# Altium project ADH_XC7Z010_SoC.PrjPcb (part 6 of 10)
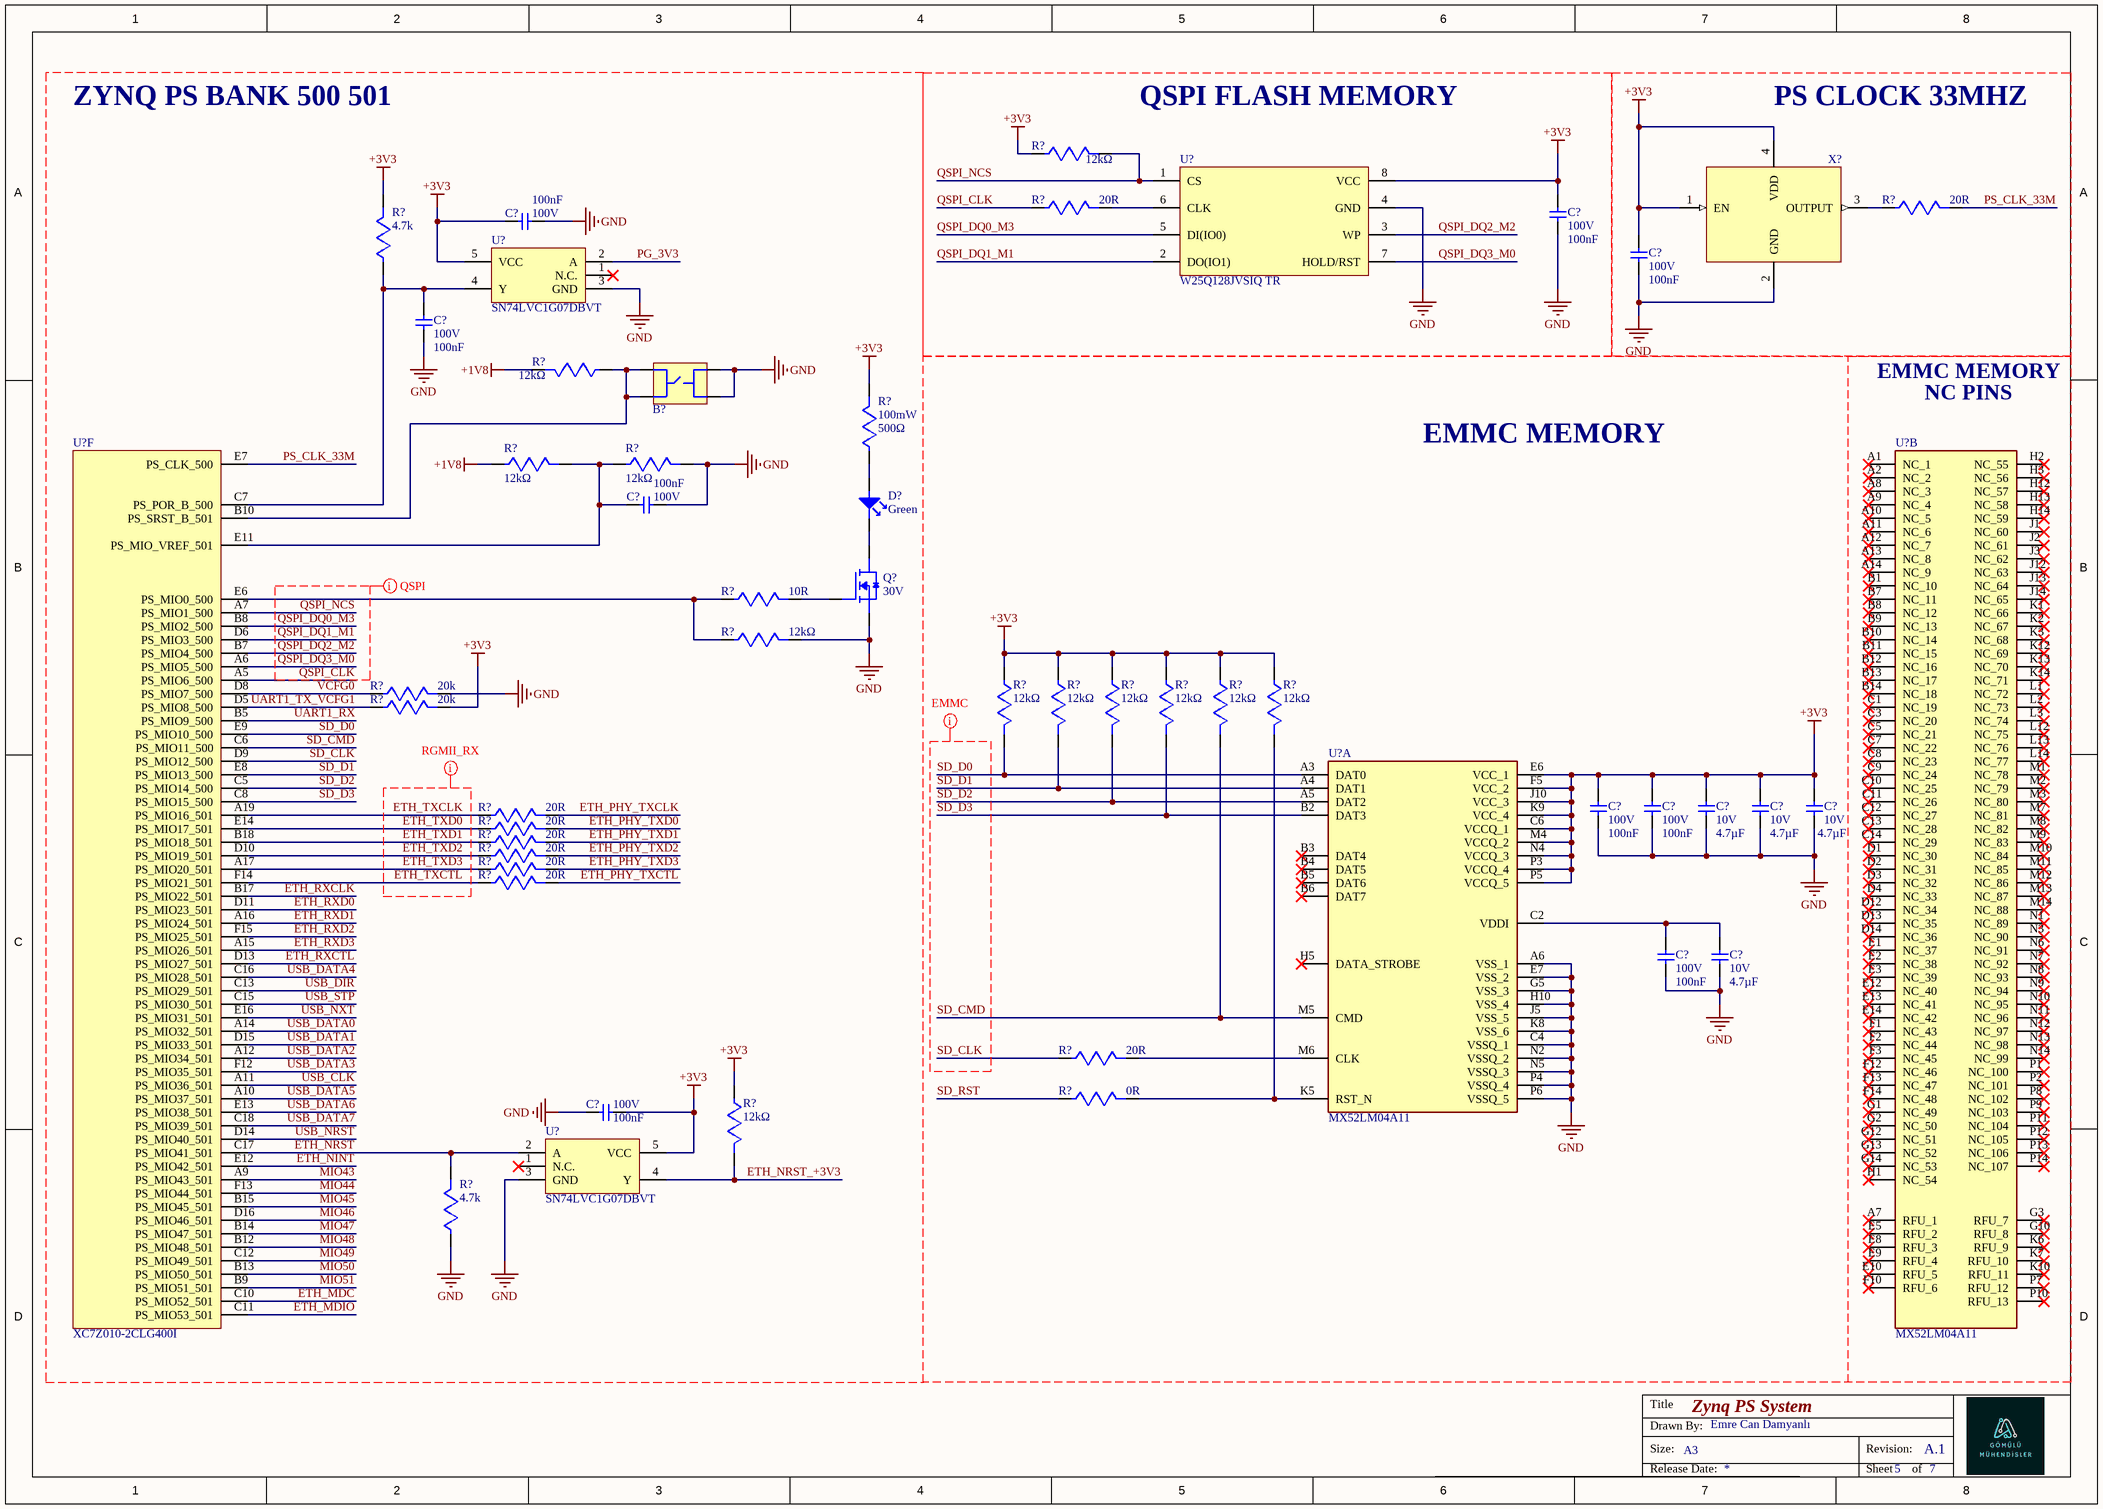
[diagram p11: Zynq_PS_System.SchDoc]

## Sheet Zynq_PS_System.SchDoc: Zynq PS System (continued)

### Library data of the parts
B?#2 = GSPTS0020: Tactile Switch SPST-NO Top Actuated Surface Mount; Datasheet: https://www.ckswitches.com/media/2728/pts815.pdf
C?#116-C?#122 C?#126 C?#128 = GCJ188R72A104KA01D: Cap Ceramic 0.1uF 100V X7R 10% Pad SMD 0603 Soft Termination 125C Automotive T/R; Manufacturer: Murata; Material: 4241ConductorMaterial; Supplier: Digikey; Supplier Part Number: 490-13420-1-ND; Manufacturer Part Number: GCJ188R72A104KA01D; RoHS: Yes; Category: Ceramic Capacitors; Stock: 681954; Pricing: 1=0,19, 10=0,123, 50=0,0774, 100=0,0619, 500=0,04472, 1000=0,03956 (USD); Mounting Technology: Surface Mount; Case/Package: 0603; Case Code (Metric): 1608; Case Code (Imperial): 0603; Min Operating Temperature: -55°C; Max Operating Temperature: 125°C; Packaging: Cut Tape; Tolerance: 10%; Features: Soft Termination; Series: GCJ; Length: 0.063inch; Width: 0.031inch; Height: 900um; Thickness: 0.035inch; Ratings: AEC-Q200; RoHS Compliant: Yes; Lead Free: 5697LeadFree; ComponentLink1URL: https://datasheet.octopart.com/GCJ188R72A104KA01D-Murata-datasheet-78375067.pdf?src-supplier=Future+Electronics; ComponentLink1Description: https://datasheet.octopart.com/GCJ188R72A104KA01D-Murata-datasheet-78375067.pdf?src-supplier=Future+Electronics; ComponentLink2URL: http://search.murata.co.jp/Ceramy/image/img/A01X/partnumbering_e_02.pdf?src-supplier=Digikey; ComponentLink2Description: http://search.murata.co.jp/Ceramy/image/img/A01X/partnumbering_e_02.pdf?src-supplier=Digikey; ComponentLink3URL: https://www.murata.com/~/media/webrenewal/support/library/catalog/products/capacitor/mlcc/c03e.ashx?la=en-us&src-supplier=Digikey; ComponentLink3Description: https://www.murata.com/~/media/webrenewal/support/library/catalog/products/capacitor/mlcc/c03e.ashx?la=en-us&src-supplier=Digikey; ComponentLink4URL: https://datasheet.octopart.com/GCJ188R72A104KA01D-Murata-datasheet-165611796.pdf?src-supplier=TME; ComponentLink4Description: https://datasheet.octopart.com/GCJ188R72A104KA01D-Murata-datasheet-165611796.pdf?src-supplier=TME
C?#123-C?#125 C?#127 = CL05A475MP5NRNC: Ceramic Capacitor, Multilayer, Ceramic, 10V, 20% +Tol, 20% -Tol, X5R, +-15% TC, 4.7uF, Surface Mount, 0402 inch; Manufacturer: Samsung Electro-Mechanics; Supplier: Avnet; Supplier Part Number: CL05A475MP5NRNC; Manufacturer Part Number: CL05A475MP5NRNC; RoHS: Compliant; Category: Ceramic Capacitors; Stock: 40000; Pricing: 10000=0,00671, 20000=0,00663, 40000=0,0066, 80000=0,00656, 160000=0,00653 (USD); Case/Package: 0402; Case Code (Imperial): 0402; Case Code (Metric): 1005; China RoHS: Compliant; Dielectric: X5R; Dielectric Material: Ceramic; Height: 500µm; Lead Free: Lead Free; Length: 1mm; Lifecycle Status: Production; Material: Ceramic; Max Operating Temperature: 85°C; Min Operating Temperature: -55°C; Mounting Technology: Surface Mount; Number of Terminals: 2; REACH SVHC: Yes; Schedule B: 8532240020, 8532240020|8532240020|8532240020|8532240020|8532240020|8532240020|8532240020|8532240020|8532240020|8532240020|8532240020|8532240020|8532240020|8532240020|8532240020|8532240020|8532240020|8532240020|8532240020|8532240020|8532240020|8532240020, 8532240020|8532240020|8532240020|8532240020|8532240020|8532240020|8532240020|8532240020|8532240020|8532240020|8532240020|8532240020|8532240020|8532240020|8532240020|8532240020|8532240020|8532240020|8532240020|8532240020|8532240020|8532240020|8532240020, 8532240020|8532240020|8532240020|8532240020|8532240020|8532240020|8532240020|8532240020|8532240020|8532240020|8532240020|8532240020|8532240020|8532240020|8532240020|8532240020|8532240020|8532240020|8532240020|8532240020|8532240020|8532240020|8532240020|85; Thickness: 558.8µm; Tolerance: 20%; Voltage Rating (DC): 10V; Width: 500µm; ComponentLink1URL: https://datasheet.octopart.com:443/CL05A475MP5NRNC-Samsung-Electro-Mechanics-datasheet-181551186.pdf?src-supplier=Newark; ComponentLink1Description: https://datasheet.octopart.com:443/CL05A475MP5NRNC-Samsung-Electro-Mechanics-datasheet-181551186.pdf?src-supplier=Newark; ComponentLink2URL: https://datasheet.octopart.com:443/CL05A475MP5NRNC-Samsung-Electro-Mechanics-datasheet-136482298.pdf?src-supplier=Newark; ComponentLink2Description: https://datasheet.octopart.com:443/CL05A475MP5NRNC-Samsung-Electro-Mechanics-datasheet-136482298.pdf?src-supplier=Newark; ComponentLink3URL: https://datasheet.octopart.com:443/CL05A475MP5NRNC-Samsung-Electro-Mechanics-datasheet-136031736.pdf?src-supplier=Future+Electronics; ComponentLink3Description: https://datasheet.octopart.com:443/CL05A475MP5NRNC-Samsung-Electro-Mechanics-datasheet-136031736.pdf?src-supplier=Future+Electronics; ComponentLink4URL: https://datasheet.octopart.com:443/CL05A475MP5NRNC-Samsung-Electro-Mechanics-datasheet-110226226.pdf?src-supplier=Future+Electronics; ComponentLink4Description: https://datasheet.octopart.com:443/CL05A475MP5NRNC-Samsung-Electro-Mechanics-datasheet-110226226.pdf?src-supplier=Future+Electronics; ComponentLink5URL: https://datasheet.octopart.com:443/CL05A475MP5NRNC-Samsung-Electro-Mechanics-datasheet-87580058.pdf?src-supplier=Future+Electronics; ComponentLink5Description: https://datasheet.octopart.com:443/CL05A475MP5NRNC-Samsung-Electro-Mechanics-datasheet-87580058.pdf?src-supplier=Future+Electronics; ComponentLink6URL: https://datasheet.octopart.com:443/CL05A475MP5NRNC-Samsung-Electro-Mechanics-datasheet-81461611.pdf?src-supplier=Future+Electronics; ComponentLink6Description: https://datasheet.octopart.com:443/CL05A475MP5NRNC-Samsung-Electro-Mechanics-datasheet-81461611.pdf?src-supplier=Future+Electronics; ComponentLink7URL: https://datasheet.octopart.com:443/CL05A475MP5NRNC-Samsung-datasheet-48647200.pdf?src-supplier=Future+Electronics; ComponentLink7Description: https://datasheet.octopart.com:443/CL05A475MP5NRNC-Samsung-datasheet-48647200.pdf?src-supplier=Future+Electronics; ComponentLink8URL: https://datasheet.octopart.com:443/CL05A475MP5NRNC-Samsung-datasheet-34153549.pdf?src-supplier=Future+Electronics; ComponentLink8Description: https://datasheet.octopart.com:443/CL05A475MP5NRNC-Samsung-datasheet-34153549.pdf?src-supplier=Future+Electronics; ComponentLink9URL: https://datasheet.octopart.com:443/CL05A475MP5NRNC-Samsung-datasheet-26589015.pdf?src-supplier=Future+Electronics; ComponentLink9Description: https://datasheet.octopart.com:443/CL05A475MP5NRNC-Samsung-datasheet-26589015.pdf?src-supplier=Future+Electronics; ComponentLink10URL: https://datasheet.octopart.com:443/CL05A475MP5NRNC-Samsung-datasheet-8324245.pdf?src-supplier=Future+Electronics; ComponentLink10Description: https://datasheet.octopart.com:443/CL05A475MP5NRNC-Samsung-datasheet-8324245.pdf?src-supplier=Future+Electronics; ComponentLink11URL: https://datasheet.octopart.com:443/CL05A475MP5NRNC-Samsung-Electro-Mechanics-datasheet-149136695.pdf?src-supplier=Future+Electronics; ComponentLink11Description: https://datasheet.octopart.com:443/CL05A475MP5NRNC-Samsung-Electro-Mechanics-datasheet-149136695.pdf?src-supplier=Future+Electronics; ComponentLink12URL: https://datasheet.octopart.com:443/CL05A475MP5NRNC-Samsung-datasheet-8326407.pdf?src-supplier=TME; ComponentLink12Description: https://datasheet.octopart.com:443/CL05A475MP5NRNC-Samsung-datasheet-8326407.pdf?src-supplier=TME
D?#7 = LTST-C191KGKT: LTST-C191KGKT Lite-On LED, green, 18-71mcd, 130, 1.9V-2.4V SMD, 0603 1.6x0.8x0.55mm RoHS; Manufacturer: Vishay Lite-On; Lens Color: Colorless; Luminous Intensity: 35mcd; Viewing Angle: 130°; Lens Style: Flat,Rectangular,Colorless; Forward Voltage: 2V; Dominant Wavelength: 571nm; Test Current: 20mA; Lens Transparency: Clear; Wavelength: 574nm; Number of LEDs: 1; Max Power Dissipation: 75mW; Lens Size: 0.8mm; Supplier: Digi-Key; Supplier Part Number: 160-1446-1-ND; Manufacturer Part Number: LTST-C191KGKT; RoHS: Yes; Stock: 1655174; Pricing: 1=0,25, 10=0,136, 100=0,063, 500=0,05818, 1000=0,04557, 2000=0,0446 (USD); Mounting Technology: Surface Mount; Case/Package: 0603; Pins: 2; Case Code (Metric): 1608; Case Code (Imperial): 0603; Min Operating Temperature: -55°C; Max Operating Temperature: 85°C; Packaging: Tape and Reel; Series: -; Length: 1.6mm; Width: 0.8mm; Height: 0.65mm; RoHS Compliant: Yes; Lead Free: Lead Free; ComponentLink1URL: https://datasheet.ciiva.com/2109/ltst-c191kgkt-2109973.pdf?src-supplier=Digi-Key; ComponentLink1Description: https://datasheet.ciiva.com/2109/ltst-c191kgkt-2109973.pdf?src-supplier=Digi-Key
Q?#6 = DMG3402L-7: MOSFET N-CH 30V 4A SOT23; Manufacturer: Diodes; Rds On Max: 52mR; Input Capacitance: 464pF; Rise Time: 1.6ns; Max Power Dissipation: 1.4W; Fall Time: 2ns; Turn-Off Delay Time: 10.3ns; Turn-On Delay Time: 1.9ns; Gate to Source Voltage (Vgs): 12V; Number of Channels: 1; Polarity: N-CHANNEL; Supplier: Digi-Key; Supplier Part Number: DMG3402L-7DICT-ND; Manufacturer Part Number: DMG3402L-7; RoHS: Yes; Category: MOSFETs; Stock: 1011067; Pricing: 1=0,42, 10=0,298, 100=0,1503, 500=0,13316, 1000=0,10363 (USD); Mounting Technology: Surface Mount; Case/Package: SOT-23; Pins: 3; Weight: 0.000282oz; Min Operating Temperature: -55°C; Max Operating Temperature: 150°C; Package Quantity: 3000; Packaging: Tape and Reel; Continuous Drain Current (ID): 4A; Drain to Source Resistance: 52mR; Series: -; RoHS Compliant: Yes; Lead Free: Lead Free; ComponentLink1URL: http://www.mouser.com/ds/2/115/DMG3402L-473526.pdf?src-supplier=Mouser; ComponentLink1Description: http://www.mouser.com/ds/2/115/DMG3402L-473526.pdf?src-supplier=Mouser; ComponentLink2URL: http://diodes.com/datasheets/DMG3402L.pdf?src-supplier=Avnet; ComponentLink2Description: http://diodes.com/datasheets/DMG3402L.pdf?src-supplier=Avnet
R?#74 R?#78 R?#80 R?#81 R?#83 R?#85-R?#90 R?#100 = RC0603FR-0712KL: 100mW Thick Film Resistors 75V ±100ppm/℃ ±1% 12kΩ 0603 Chip Resistor - Surface Mount ROHS; Manufacturer: Yageo Group; Temperature Coefficient: 100ppm/°C; Voltage Rating: 50V; Supplier: Farnell; Supplier Part Number: 9238611; Manufacturer Part Number: RC0603FR-0712KL; RoHS: Compliant; Category: Chip SMD Resistors; Stock: 298850; Pricing: 10=0,0061, 100=0,0052, 500=0,0048, 1000=0,0043, 2500=0,0036 (EUR); Case/Package: 0603; Case Code (Imperial): 0603; Case Code (Metric): 1608; China RoHS: Non-Compliant; Composition: Thick Film; Depth: 800µm; Features: Moisture Resistant; Height: 450µm; Lead Free: Lead Free; Length: 1.6mm; Lifecycle Status: Production; Max Operating Temperature: 155°C; Max Power Dissipation: 100mW; Military Standard: Not; Min Operating Temperature: -55°C; Mounting Technology: Surface Mount; Pins: 2; Number of Terminals: 2; Number of Terminations: 2; Packaging: Tape and Reel; Power Dissipation: 100mW; Power Rating: 100mW; REACH SVHC: Yes; Schedule B: 8533210045, 8533210045|8533210045|8533210045|8533210045|8533210045; Termination: SMD/SMT; Tolerance: 1%; Voltage Rating (DC): 50V; Width: 800µm; Working Voltage: 75V; ComponentLink1URL: https://datasheet.octopart.com:443/RC0603FR-0712KL-Yageo-datasheet-175887523.pdf?src-supplier=IHS; ComponentLink1Description: https://datasheet.octopart.com:443/RC0603FR-0712KL-Yageo-datasheet-175887523.pdf?src-supplier=IHS; ComponentLink2URL: https://datasheet.octopart.com:443/RC0603FR-0712KL-Yageo-datasheet-8328172.pdf?src-supplier=Newark; ComponentLink2Description: https://datasheet.octopart.com:443/RC0603FR-0712KL-Yageo-datasheet-8328172.pdf?src-supplier=Newark; ComponentLink3URL: https://datasheet.octopart.com:443/RC0603FR-0712KL-Yageo-datasheet-175423674.pdf?src-supplier=Newark; ComponentLink3Description: https://datasheet.octopart.com:443/RC0603FR-0712KL-Yageo-datasheet-175423674.pdf?src-supplier=Newark; ComponentLink4URL: https://datasheet.octopart.com:443/RC0603FR-0712KL-Yageo-datasheet-34211833.pdf?src-supplier=Newark; ComponentLink4Description: https://datasheet.octopart.com:443/RC0603FR-0712KL-Yageo-datasheet-34211833.pdf?src-supplier=Newark; ComponentLink5URL: https://datasheet.octopart.com:443/RC0603FR-0712KL-Yageo-datasheet-62067350.pdf?src-supplier=element14+APAC; ComponentLink5Description: https://datasheet.octopart.com:443/RC0603FR-0712KL-Yageo-datasheet-62067350.pdf?src-supplier=element14+APAC; ComponentLink6URL: https://datasheet.octopart.com:443/RC0603FR-0712KL-Yageo-datasheet-103092701.pdf?src-supplier=Upverter; ComponentLink6Description: https://datasheet.octopart.com:443/RC0603FR-0712KL-Yageo-datasheet-103092701.pdf?src-supplier=Upverter; ComponentLink7URL: https://datasheet.octopart.com:443/RC0603FR-0712KL-Yageo-datasheet-141435368.pdf?src-supplier=Upverter; ComponentLink7Description: https://datasheet.octopart.com:443/RC0603FR-0712KL-Yageo-datasheet-141435368.pdf?src-supplier=Upverter; ComponentLink8URL: https://datasheet.octopart.com:443/RC0603FR-0712KL-Yageo-Group-datasheet-190305687.pdf?src-supplier=Future+Electronics; ComponentLink8Description: https://datasheet.octopart.com:443/RC0603FR-0712KL-Yageo-Group-datasheet-190305687.pdf?src-supplier=Future+Electronics; ComponentLink9URL: https://datasheet.octopart.com:443/RC0603FR-0712KL-Yageo-datasheet-164759695.pdf?src-supplier=Future+Electronics; ComponentLink9Description: https://datasheet.octopart.com:443/RC0603FR-0712KL-Yageo-datasheet-164759695.pdf?src-supplier=Future+Electronics; ComponentLink10URL: https://datasheet.octopart.com:443/RC0603FR-0712KL-Yageo-datasheet-137700087.pdf?src-supplier=Future+Electronics; ComponentLink10Description: https://datasheet.octopart.com:443/RC0603FR-0712KL-Yageo-datasheet-137700087.pdf?src-supplier=Future+Electronics; ComponentLink11URL: https://datasheet.octopart.com:443/RC0603FR0712KL-Yageo-datasheet-27584510.pdf?src-supplier=Future+Electronics; ComponentLink11Description: https://datasheet.octopart.com:443/RC0603FR0712KL-Yageo-datasheet-27584510.pdf?src-supplier=Future+Electronics; ComponentLink12URL: https://datasheet.octopart.com:443/RC0603FR-0712KL-Yageo-datasheet-15599030.pdf?src-supplier=Future+Electronics; ComponentLink12Description: https://datasheet.octopart.com:443/RC0603FR-0712KL-Yageo-datasheet-15599030.pdf?src-supplier=Future+Electronics; ComponentLink13URL: https://datasheet.octopart.com:443/RC0603FR-0712KL-Yageo-datasheet-12596169.pdf?src-supplier=Future+Electronics; ComponentLink13Description: https://datasheet.octopart.com:443/RC0603FR-0712KL-Yageo-datasheet-12596169.pdf?src-supplier=Future+Electronics; ComponentLink14URL: https://datasheet.octopart.com:443/RC0603FR-0712KL-Yageo-datasheet-8324193.pdf?src-supplier=Future+Electronics; ComponentLink14Description: https://datasheet.octopart.com:443/RC0603FR-0712KL-Yageo-datasheet-8324193.pdf?src-supplier=Future+Electronics; ComponentLink15URL: https://datasheet.octopart.com:443/RC0603FR-0712KL-Yageo-Group-datasheet-176638170.pdf?src-supplier=Farnell; ComponentLink15Description: https://datasheet.octopart.com:443/RC0603FR-0712KL-Yageo-Group-datasheet-176638170.pdf?src-supplier=Farnell; ComponentLink16URL: https://datasheet.octopart.com/RC0603FR-0712KL-Yageo-datasheet-73766026.pdf; ComponentLink16Description: https://datasheet.octopart.com/RC0603FR-0712KL-Yageo-datasheet-73766026.pdf; ComponentLink17URL: https://datasheet.octopart.com:443/RC0603FR-0712KL-Yageo-datasheet-30459151.pdf?src-supplier=Seeed+Studio; ComponentLink17Description: https://datasheet.octopart.com:443/RC0603FR-0712KL-Yageo-datasheet-30459151.pdf?src-supplier=Seeed+Studio; ComponentLink18URL: https://datasheet.octopart.com:443/RC0603FR-0712KL-Yageo-datasheet-118562.pdf?src-supplier=DigiKey; ComponentLink18Description: https://datasheet.octopart.com:443/RC0603FR-0712KL-Yageo-datasheet-118562.pdf?src-supplier=DigiKey; ComponentLink19URL: http://sigma.octopart.com:80/conflict_mineral_statement/Yageo-company-3.pdf?src-supplier=Compliance+Statements; ComponentLink19Description: http://sigma.octopart.com:80/conflict_mineral_statement/Yageo-company-3.pdf?src-supplier=Compliance+Statements; ComponentLink20URL: http://sigma.octopart.com:80/rohs_statement/Yageo-company-2.pdf?src-supplier=Compliance+Statements; ComponentLink20Description: http://sigma.octopart.com:80/rohs_statement/Yageo-company-2.pdf?src-supplier=Compliance+Statements
R?#75 R?#76 R?#92-R?#98 = RC0603FR-0720RL: SMD Chip Resistor, 20 Ohm, ± 1%, 100 mW, 0603 [1608 Metric], Thick Film, General Purpose; Manufacturer: Yageo; Power Rating: 100mW; Voltage Rating: 50V; Temperature Coefficient: 100ppm/°C; Working Voltage: 75V; Supplier: Digi-Key; Supplier Part Number: 311-20.0HRCT-ND; Manufacturer Part Number: RC0603FR-0720RL; RoHS: Yes; Category: Chip SMD Resistors; Stock: 293682; Pricing: 1=0,1, 10=0,018, 50=0,0106, 100=0,0088, 500=0,00592, 1000=0,00505 (USD); Case/Package: 0603; Case Code (Imperial): 0603; Case Code (Metric): 1608; Min Operating Temperature: -55°C; Max Operating Temperature: 155°C; Tolerance: 1%; Packaging: Tape and Reel; Package Quantity: 5000; Termination: SMD/SMT; Resistor Type: Thick Film; Number of Terminations: 2; Max Power Dissipation: 100mW; Voltage Rating (DC): 50V; Features: Moisture Resistant; Series: RC; Construction: Rectangular; Technology: THICK FILM; Resistance Tolerance: 1%; Length: 1.6mm; Width: 0.031inch; Height: 0.45mm; Depth: 0.8mm; Reach SVHC Compliant: No; Military Standard: Not; Lead Free: Lead Free; RoHS Compliant: Yes; ComponentLink1URL: https://datasheet.ciiva.com/11819/0900766b80f96399-11819290.pdf?src-supplier=Rs; ComponentLink1Description: https://datasheet.ciiva.com/11819/0900766b80f96399-11819290.pdf?src-supplier=Rs; ComponentLink2URL: https://datasheet.ciiva.com/46395/443971-46395031.pdf?src-supplier=Element14; ComponentLink2Description: https://datasheet.ciiva.com/46395/443971-46395031.pdf?src-supplier=Element14; ComponentLink3URL: https://datasheet.ciiva.com/2454/pyu-r-int-thick-7-2454028.pdf?src-supplier=Digi-Key; ComponentLink3Description: https://datasheet.ciiva.com/2454/pyu-r-int-thick-7-2454028.pdf?src-supplier=Digi-Key; ComponentLink4URL: https://datasheet.ciiva.com/2454/pyu-r-int-thick-7-2454029.pdf?src-supplier=Digi-Key; ComponentLink4Description: https://datasheet.ciiva.com/2454/pyu-r-int-thick-7-2454029.pdf?src-supplier=Digi-Key; ComponentLink5URL: https://datasheet.ciiva.com/2454/pyu-r-int-thick-7-2454027.pdf?src-supplier=Digi-Key; ComponentLink5Description: https://datasheet.ciiva.com/2454/pyu-r-int-thick-7-2454027.pdf?src-supplier=Digi-Key; ComponentLink6URL: https://datasheet.ciiva.com/12557/rc0603-272842-12557941.pdf?src-supplier=Mouser; ComponentLink6Description: https://datasheet.ciiva.com/12557/rc0603-272842-12557941.pdf?src-supplier=Mouser; ComponentLink7URL: https://datasheet.ciiva.com/15189/getdatasheetpartid-324013-15189653.pdf?src-supplier=Verical; ComponentLink7Description: https://datasheet.ciiva.com/15189/getdatasheetpartid-324013-15189653.pdf?src-supplier=Verical
R?#77 R?#101 = RC0603FR-074K7L: SMD Chip Resistor, 4.7 kOhm, ± 1%, 100 mW, 0603 [1608 Metric], Thick Film, General Purpose; Manufacturer: Yageo; Power Rating: 100mW; Voltage Rating (DC): 50V; Temperature Coefficient: 100ppm/°C; Supplier: Digi-Key; Supplier Part Number: 311-4.70KHRCT-ND; Manufacturer Part Number: RC0603FR-074K7L; RoHS: Yes; Category: Chip SMD Resistors; Stock: 7233601; Pricing: 1=0,1, 10=0,018, 50=0,0106, 100=0,0088, 500=0,00592, 1000=0,00505 (USD); Case/Package: 0603; Pins: 2; Case Code (Imperial): 0603; Case Code (Metric): 1608; Min Operating Temperature: -55°C; Max Operating Temperature: 155°C; Tolerance: 1%; Resistor Type: Thick Film; Packaging: Tape and Reel; Voltage Rating: 50V; Termination: SMD/SMT; Features: Moisture Resistant; Series: RC; Max Power Dissipation: 100mW; Number of Terminations: 2; Construction: Rectangular; Resistance Tolerance: 1%; Length: 1.6mm; Width: 0.8mm; Depth: 0.8mm; Lead Pitch: 0.3mm; Lead Free: Lead Free; Reach SVHC Compliant: Unknown; RoHS Compliant: Yes; Military Standard: Not; ComponentLink1URL: https://datasheet.ciiva.com/15189/getdatasheetpartid-422754-15189760.pdf?src-supplier=Verical; ComponentLink1Description: https://datasheet.ciiva.com/15189/getdatasheetpartid-422754-15189760.pdf?src-supplier=Verical; ComponentLink2URL: https://datasheet.ciiva.com/7660/38590-7660794.pdf?src-supplier=Element14; ComponentLink2Description: https://datasheet.ciiva.com/7660/38590-7660794.pdf?src-supplier=Element14; ComponentLink3URL: https://datasheet.ciiva.com/22747/443971-22747528.pdf?src-supplier=Element14; ComponentLink3Description: https://datasheet.ciiva.com/22747/443971-22747528.pdf?src-supplier=Element14; ComponentLink4URL: https://datasheet.ciiva.com/46440/1868787-46440909.pdf?src-supplier=Element14; ComponentLink4Description: https://datasheet.ciiva.com/46440/1868787-46440909.pdf?src-supplier=Element14; ComponentLink5URL: https://datasheet.ciiva.com/7746/1868787-7746365.pdf?src-supplier=Element14; ComponentLink5Description: https://datasheet.ciiva.com/7746/1868787-7746365.pdf?src-supplier=Element14; ComponentLink6URL: https://datasheet.ciiva.com/7746/1738695-7746366.pdf?src-supplier=Element14; ComponentLink6Description: https://datasheet.ciiva.com/7746/1738695-7746366.pdf?src-supplier=Element14
R?#79 = RT0603BRC07500RL: Fixed Resistor, Thin Film, 0.1W, 500ohm, 75V, 0.1% +/-Tol, 15ppm/Cel, Surface Mount, 0603; Manufacturer: Yageo Group; Temperature Coefficient: 15ppm/°C; Supplier: Farnell; Supplier Part Number: 4152629; Manufacturer Part Number: RT0603BRC07500RL; RoHS: Compliant; Category: Chip SMD Resistors; Stock: 4870; Pricing: 5000=0,12 (EUR); Case/Package: 0603; China RoHS: Non-Compliant; Composition: Thin Film; Height: 450µm; Lifecycle Status: Production; Max Operating Temperature: 155°C; Min Operating Temperature: -55°C; Mounting Technology: Surface Mount; Number of Terminals: 2; Packaging: Tape & Reel; Power Dissipation: 100mW; REACH SVHC: Yes; Tolerance: 0.1%; Voltage Rating: 75V; Width: 800µm; Working Voltage: 75V; ComponentLink1URL: https://datasheet.octopart.com:443/RT0603BRC07500RL-Yageo-datasheet-176402239.pdf?src-supplier=IHS; ComponentLink1Description: https://datasheet.octopart.com:443/RT0603BRC07500RL-Yageo-datasheet-176402239.pdf?src-supplier=IHS; ComponentLink2URL: https://datasheet.octopart.com:443/RT0603BRC07500RL-Yageo-datasheet-141265893.pdf?src-supplier=ODG+(Origin+Data+Global); ComponentLink2Description: https://datasheet.octopart.com:443/RT0603BRC07500RL-Yageo-datasheet-141265893.pdf?src-supplier=ODG+(Origin+Data+Global); ComponentLink3URL: https://datasheet.octopart.com:443/RT0603BRC07500RL-Yageo-datasheet-169971040.pdf?src-supplier=Upverter; ComponentLink3Description: https://datasheet.octopart.com:443/RT0603BRC07500RL-Yageo-datasheet-169971040.pdf?src-supplier=Upverter; ComponentLink4URL: https://datasheet.octopart.com:443/RT0603BRC07500RL-Yageo-datasheet-166250672.pdf?src-supplier=Future+Electronics; ComponentLink4Description: https://datasheet.octopart.com:443/RT0603BRC07500RL-Yageo-datasheet-166250672.pdf?src-supplier=Future+Electronics; ComponentLink5URL: https://datasheet.octopart.com/RT0603BRC07500RL-Yageo-datasheet-86813807.pdf; ComponentLink5Description: https://datasheet.octopart.com/RT0603BRC07500RL-Yageo-datasheet-86813807.pdf; ComponentLink6URL: http://sigma.octopart.com:80/rohs_statement/Yageo-company-2.pdf?src-supplier=Compliance+Statements; ComponentLink6Description: http://sigma.octopart.com:80/rohs_statement/Yageo-company-2.pdf?src-supplier=Compliance+Statements; ComponentLink7URL: http://sigma.octopart.com:80/conflict_mineral_statement/Yageo-company-3.pdf?src-supplier=Compliance+Statements; ComponentLink7Description: http://sigma.octopart.com:80/conflict_mineral_statement/Yageo-company-3.pdf?src-supplier=Compliance+Statements
R?#82 = RC0603FR-0710RL: SMD Chip Resistor, 10 Ohm, ± 1%, 100 mW, 0603 [1608 Metric], Thick Film, General Purpose; Manufacturer: Yageo; Voltage Rating (DC): 50V; Temperature Coefficient: 200ppm/°C; Max Power Dissipation: 100mW; Supplier: Digi-Key; Supplier Part Number: 311-10.0HRCT-ND; Manufacturer Part Number: RC0603FR-0710RL; RoHS: Yes; Category: Chip SMD Resistors; Stock: 1593496; Pricing: 1=0,1, 10=0,028, 50=0,018, 100=0,015, 500=0,0104, 1000=0,00901 (USD); Case/Package: 0603; Pins: 2; Case Code (Imperial): 0603; Case Code (Metric): 1608; Contact Plating: Tin,Matte; Min Operating Temperature: -55°C; Max Operating Temperature: 155°C; Packaging: Tape and Reel; Tolerance: 1%; Features: Moisture Resistant; Series: RC; Number of Terminations: 2; Power Rating: 100mW; Voltage Rating: 50V; Termination: SMD/SMT; Resistor Type: Thick Film; Resistance Tolerance: 1%; Construction: Rectangular; Technology: THICK FILM; Voltage Rating (AC): 50V; Length: 1.6mm; Width: 0.8mm; Height: 0.45mm; Depth: 0.8mm; Lead Free: Lead Free; RoHS Compliant: Yes; Reach SVHC Compliant: No; Military Standard: Not; ComponentLink1URL: https://datasheet.ciiva.com/11808/0900766b80f96399-11808140.pdf?src-supplier=Rs; ComponentLink1Description: https://datasheet.ciiva.com/11808/0900766b80f96399-11808140.pdf?src-supplier=Rs; ComponentLink2URL: https://datasheet.ciiva.com/7746/443971-7746245.pdf?src-supplier=Element14; ComponentLink2Description: https://datasheet.ciiva.com/7746/443971-7746245.pdf?src-supplier=Element14; ComponentLink3URL: https://datasheet.ciiva.com/8891/pyu-rc0603-51-rohs-l-4-8891285.pdf?src-supplier=Avnet; ComponentLink3Description: https://datasheet.ciiva.com/8891/pyu-rc0603-51-rohs-l-4-8891285.pdf?src-supplier=Avnet
R?#84 R?#91 = RC0603FR-0720KL: SMD Chip Resistor, 20 kOhm, ± 1%, 100 mW, 0603 [1608 Metric], Thick Film, General Purpose; Manufacturer: Yageo; Temperature Coefficient: 100ppm/°C; Voltage Rating (DC): 50V; Power Rating: 100mW; Supplier: Digi-Key; Supplier Part Number: 311-20.0KHRCT-ND; Manufacturer Part Number: RC0603FR-0720KL; RoHS: Yes; Category: Chip SMD Resistors; Stock: 6106196; Pricing: 1=0,1, 10=0,018, 50=0,0106, 100=0,0088, 500=0,00592, 1000=0,00505 (USD); Case/Package: 0603; Pins: 2NUMBER; Case Code (Imperial): 0603; Case Code (Metric): 1608; Min Operating Temperature: -55°C; Max Operating Temperature: 155°C; Tolerance: 1%; Packaging: Tape and Reel; Resistor Type: Thick Film; Voltage Rating: 50V; Package Quantity: 1; Termination: SMD/SMT; Number of Terminations: 2; Max Power Dissipation: 100mW; Features: Moisture Resistant; Series: RC; Technology: THICK FILM; Construction: Rectangular; Resistance Tolerance: 1%; Length: 0.063inch; Width: 0.031inch; Height: 0.022inch; Depth: 0.8mm; RoHS Compliant: Yes; Lead Free: 5697LeadFree; Reach SVHC Compliant: No; Military Standard: Not; ComponentLink1URL: https://datasheet.ciiva.com/11808/0900766b80f96399-11808275.pdf?src-supplier=Rs; ComponentLink1Description: https://datasheet.ciiva.com/11808/0900766b80f96399-11808275.pdf?src-supplier=Rs; ComponentLink2URL: https://datasheet.ciiva.com/22747/443971-22747525.pdf?src-supplier=Element14; ComponentLink2Description: https://datasheet.ciiva.com/22747/443971-22747525.pdf?src-supplier=Element14; ComponentLink3URL: https://datasheet.ciiva.com/2453/pyu-r-int-thick-7-2453911.pdf?src-supplier=Digi-Key; ComponentLink3Description: https://datasheet.ciiva.com/2453/pyu-r-int-thick-7-2453911.pdf?src-supplier=Digi-Key; ComponentLink4URL: https://datasheet.ciiva.com/2453/pyu-r-int-thick-7-2453912.pdf?src-supplier=Digi-Key; ComponentLink4Description: https://datasheet.ciiva.com/2453/pyu-r-int-thick-7-2453912.pdf?src-supplier=Digi-Key; ComponentLink5URL: https://datasheet.ciiva.com/2453/pyu-r-int-thick-7-2453910.pdf?src-supplier=Digi-Key; ComponentLink5Description: https://datasheet.ciiva.com/2453/pyu-r-int-thick-7-2453910.pdf?src-supplier=Digi-Key
R?#99 = RC0603FR-070RL: Zero Ohm Resistor, Jumper, 0603 [1608 Metric], Thick Film, 100 mW, 1 A, Surface Mount; Manufacturer: Yageo; Power Rating: 100mW; Tolerance: 1%; Voltage Rating (DC): 50V; Temperature Coefficient: 200ppm/°C; Supplier: Digi-Key; Supplier Part Number: 311-0.0HRCT-ND; Manufacturer Part Number: RC0603FR-070RL; RoHS: Yes; Category: Chip SMD Resistors; Stock: 1785115; Pricing: 1=0,1, 10=0,017, 25=0,0132, 50=0,01, 100=0,007, 250=0,0056, 500=0,00448, 1000=0,00329 (USD); Case/Package: 0603; Pins: 2NUMBER; Contact Plating: Tin,Matte; Case Code (Metric): 1608; Case Code (Imperial): 0603; Min Operating Temperature: -55°C; Max Operating Temperature: 155°C; Packaging: Tape and Reel; Resistor Type: Thick Film; Package Quantity: 5000; Voltage Rating: 50V; Number of Terminations: 2; Termination: SMD/SMT; Max Power Dissipation: 100mW; Features: Moisture Resistant; Series: RC; Construction: Rectangular; Resistance Tolerance: 1%; Technology: THICK FILM; Length: 1.6mm; Width: 0.8mm; Height: 0.45mm; Depth: 0.8mm; Reach SVHC Compliant: No; RoHS Compliant: Yes; Lead Free: 5697LeadFree; Military Standard: Not; ComponentLink1URL: https://datasheet.ciiva.com/11808/0900766b80f96399-11808172.pdf?src-supplier=Rs; ComponentLink1Description: https://datasheet.ciiva.com/11808/0900766b80f96399-11808172.pdf?src-supplier=Rs; ComponentLink2URL: https://datasheet.ciiva.com/5684/443971-5684699.pdf?src-supplier=Farnell; ComponentLink2Description: https://datasheet.ciiva.com/5684/443971-5684699.pdf?src-supplier=Farnell; ComponentLink3URL: https://datasheet.ciiva.com/7983/443971-7983627.pdf?src-supplier=Element14; ComponentLink3Description: https://datasheet.ciiva.com/7983/443971-7983627.pdf?src-supplier=Element14; ComponentLink4URL: https://datasheet.ciiva.com/22643/1868787-22643388.pdf?src-supplier=Element14; ComponentLink4Description: https://datasheet.ciiva.com/22643/1868787-22643388.pdf?src-supplier=Element14; ComponentLink5URL: https://datasheet.ciiva.com/46382/443971-46382072.pdf?src-supplier=Element14; ComponentLink5Description: https://datasheet.ciiva.com/46382/443971-46382072.pdf?src-supplier=Element14; ComponentLink6URL: https://datasheet.ciiva.com/29721/pyu-r-int-thick-7-29721178.pdf?src-supplier=Digi-Key; ComponentLink6Description: https://datasheet.ciiva.com/29721/pyu-r-int-thick-7-29721178.pdf?src-supplier=Digi-Key; ComponentLink7URL: https://datasheet.ciiva.com/29721/pyu-rc0603-51-rohs-l-4-29721179.pdf?src-supplier=Digi-Key; ComponentLink7Description: https://datasheet.ciiva.com/29721/pyu-rc0603-51-rohs-l-4-29721179.pdf?src-supplier=Digi-Key; ComponentLink8URL: https://datasheet.ciiva.com/5558/rc0603-272842-5558341.pdf?src-supplier=Mouser; ComponentLink8Description: https://datasheet.ciiva.com/5558/rc0603-272842-5558341.pdf?src-supplier=Mouser
U?#14 = W25Q128JVSIQ TR: Flash, 16MX8, PDSO8; Manufacturer: Winbond; Package Body Material: Plastic; Clock Frequency: 133MHz; Density: 134217728b; Memory Width: 8; Channels: 1; Memory Size: 16777216; Number of Words Code: 16M; Operating Mode: SYNCHRONOUS; Parallel/Serial: SERIAL; Programming Voltage: 3V; Max Supply Voltage: 3.6V; Min Supply Voltage: 2.7V; Supplier 1: Digikey; Manufacturer Part Number: W25Q128JVSIQ TR; RoHS: Yes; Category: Flash; Stock 1: 326186; Pricing 1: 1=1.72, 10=1.572, 25=1.53, 50=1.522, 100=1.3605, 250=1.3566, 500=1.3361, 1000=1.27939 (USD); Case/Package: SOP; Pins: 8; Package Shape: Square; Min Operating Temperature: -40°C; Max Operating Temperature: 85°C; Memory Format: FLASH; Type: NOR TYPE; JESD-30 Code: S-PDSO-G8; Organization: 16MX8; Package Style: SMALL OUTLINEMeter; Nominal Supply Voltage: 3V; Surface Mount: Yes; Technology: CMOS; Terminal Form: Gull Wing; Terminal Position: DUAL; Length: 5.23mm; Width: 5.23mm; Height - Seated (Max): 2.16mm; Terminal Pitch: 1.27mm; Temperature Grade: INDUSTRIAL; Reach SVHC Compliant: Yes; RoHS Compliant: Yes; ComponentLink1URL: https://datasheet.ciiva.com:443/pdfs/VipMasterIC/IC/WBND/WBND-S-A0002933800/WBND-S-A0002933800-1.pdf?src-supplier=IHS+Markit; ComponentLink1Description: https://datasheet.ciiva.com:443/pdfs/VipMasterIC/IC/WBND/WBND-S-A0002933800/WBND-S-A0002933800-1.pdf?src-supplier=IHS+Markit; ComponentLink2URL: http://www.winbond.com/resource-files/w25q128jv%20revf%2003272018%20plus.pdf?src-supplier=Digikey; ComponentLink2Description: http://www.winbond.com/resource-files/w25q128jv%20revf%2003272018%20plus.pdf?src-supplier=Digikey; ComponentLink3URL: http://www.winbond.com/resource-files/w25q128jv%20spi%20revc%2011162016.pdf?src-supplier=Digikey; ComponentLink3Description: http://www.winbond.com/resource-files/w25q128jv%20spi%20revc%2011162016.pdf?src-supplier=Digikey; Supplier Part Number 1: W25Q128JVSIQCT-ND
U?#15 U?#19 = SN74LVC1G07DBVT: 32mA 1 1.65V~5.5V 1 SOT-23-5 Buffer/Driver/Transceiver ROHS; Manufacturer: Texas Instruments; Manufacturer Lifecycle Status: ACTIVE; Logic Function: Buffer, Inverting; Max Junction Temperature (Tj): 150°C; Max Supply Voltage: 5.5V; Min Supply Voltage: 1.65V; Nominal Supply Current: 10µA; Number of Bits: 1; Polarity: Non-Inverting; Propagation Delay: 4ns; Turn-On Delay Time: 8.3ns; Supplier: Arrow Electronics; Supplier Part Number: SN74LVC1G07DBVT; Manufacturer Part Number: SN74LVC1G07DBVT; RoHS: Compliant; Category: Buffers, Drivers and Transceivers; Stock: 10; Pricing: 1=0,5486, 10=0,3682 (USD); Ambient Temperature Range High: 125°C; Case/Package: SOT-23; Height: 1.45mm; Lead Free: Lead Free; Length: 2.9mm; Lifecycle Status: Production; Low Level Output Current: 32mA; Max Operating Temperature: 125°C; Min Operating Temperature: -40°C; Mounting Technology: Surface Mount; Number of Bits per Element: 1; Number of Channels: 1; Number of Circuits: 1; Number of Elements: 1; Number of Gates: 1; Number of Input Lines: 1; Number of Inputs: 1; Number of Output Lines: 1; Number of Outputs: 1; Pins: 5; Packaging: Cut Tape; Quiescent Current: 10µA; Radiation Hardening: No; REACH SVHC: No; Schedule B: 8542390000, 8542390000|8542390000|8542390000|8542390000|8542390000|8542390000|8542390000|8542390000|8542390000|8542390000|8542390000|8542390000|8542390000|8542390000|8542390000|8542390000|8542390000|8542390000|8542390000|8542390000|8542390000|8542390000|8542390000|85; Termination: SMD/SMT; Thickness: 1.2mm; Width: 1.6mm; ComponentLink1URL: https://sigma.octopart.com:443/177332311/technical_drawing/Texas-Instruments-SN74LVC1G07DBVT.pdf?src-supplier=Texas+Instruments; ComponentLink1Description: https://sigma.octopart.com:443/177332311/technical_drawing/Texas-Instruments-SN74LVC1G07DBVT.pdf?src-supplier=Texas+Instruments; ComponentLink2URL: https://octopart.com:443/opatz8j6/c1?t=RA1ceLmCAqHPZwS4WBWL5MviyE-KPQgssl4QIPP4hkYXy01U65DpOM4OXHb7dM_TRyM3HiXpErdHJQEWc1zCNhzG-J5W9-gq9VzQHq0AHb711AZgtfa2gXQ-FXMmb-AxobmP_spfwIxXQxjDSjUy8RNySBUjlN5T5hfYl4oHWGsQ9M720g_DYz0B2ezIb8BEUYlrK8NQiE3Q6laiMDc2IucXkrRp5ciQFN4ZWf_zybGYYhLcrQT4xSG3tnwz2opb-2UMPMYxrvQox3Bl1YiVktS6gKf9h9R3ee7QKioW2jUNs528TEurA-eZB1T1lUOc7G5g9UcqomHeYhCbsf0OE_SMwoBUrdfdqjGZYAaPugKCI7tPa5BgLvTVFfdYyMbb3Xv0xYtsPvM&src-supplier=Texas+Instruments; ComponentLink2Description: https://octopart.com:443/opatz8j6/c1?t=RA1ceLmCAqHPZwS4WBWL5MviyE-KPQgssl4QIPP4hkYXy01U65DpOM4OXHb7dM_TRyM3HiXpErdHJQEWc1zCNhzG-J5W9-gq9VzQHq0AHb711AZgtfa2gXQ-FXMmb-AxobmP_spfwIxXQxjDSjUy8RNySBUjlN5T5hfYl4oHWGsQ9M720g_DYz0B2ezIb8BEUYlrK8NQiE3Q6laiMDc2IucXkrRp5ciQFN4ZWf_zybGYYhLcrQT4xSG3tnwz2opb-2UMPMYxrvQox3Bl1YiVktS6gKf9h9R3ee7QKioW2jUNs528TEurA-eZB1T1lUOc7G5g9UcqomHeYhCbsf0OE_SMwoBUrdfdqjGZYAaPugKCI7tPa5BgLvTVFfdYyMbb3Xv0xYtsPvM&src-supplier=Texas+Instruments; ComponentLink3URL: https://datasheet.octopart.com:443/SN74LVC1G07DBVT-Texas-Instruments-datasheet-10899237.pdf?src-supplier=Texas+Instruments; ComponentLink3Description: https://datasheet.octopart.com:443/SN74LVC1G07DBVT-Texas-Instruments-datasheet-10899237.pdf?src-supplier=Texas+Instruments; ComponentLink4URL: https://sigma.octopart.com:443/175570406/technical_drawing/Texas-Instruments-SN74LVC1G07DBVT.pdf?src-supplier=Texas+Instruments; ComponentLink4Description: https://sigma.octopart.com:443/175570406/technical_drawing/Texas-Instruments-SN74LVC1G07DBVT.pdf?src-supplier=Texas+Instruments; ComponentLink5URL: https://sigma.octopart.com:443/169406034/technical_drawing/Texas-Instruments-SN74LVC1G07DBVT.pdf?src-supplier=Texas+Instruments; ComponentLink5Description: https://sigma.octopart.com:443/169406034/technical_drawing/Texas-Instruments-SN74LVC1G07DBVT.pdf?src-supplier=Texas+Instruments; ComponentLink6URL: https://sigma.octopart.com:443/155939316/technical_drawing/Texas-Instruments-SN74LVC1G07DBVT.pdf?src-supplier=Texas+Instruments; ComponentLink6Description: https://sigma.octopart.com:443/155939316/technical_drawing/Texas-Instruments-SN74LVC1G07DBVT.pdf?src-supplier=Texas+Instruments; ComponentLink7URL: https://sigma.octopart.com:443/102331370/technical_drawing/Texas-Instruments-SN74LVC1G07DBVT.pdf?src-supplier=Texas+Instruments; ComponentLink7Description: https://sigma.octopart.com:443/102331370/technical_drawing/Texas-Instruments-SN74LVC1G07DBVT.pdf?src-supplier=Texas+Instruments; ComponentLink8URL: https://sigma.octopart.com:443/49249325/technical_drawing/Texas-Instruments-SN74LVC1G07DBVT.pdf?src-supplier=Texas+Instruments; ComponentLink8Description: https://sigma.octopart.com:443/49249325/technical_drawing/Texas-Instruments-SN74LVC1G07DBVT.pdf?src-supplier=Texas+Instruments; ComponentLink9URL: https://datasheet.octopart.com:443/SN74LVC1G07DBVT-Texas-Instruments-datasheet-25356048.pdf?src-supplier=Texas+Instruments; ComponentLink9Description: https://datasheet.octopart.com:443/SN74LVC1G07DBVT-Texas-Instruments-datasheet-25356048.pdf?src-supplier=Texas+Instruments; ComponentLink10URL: https://datasheet.octopart.com:443/SN74LVC1G07DBVT-Texas-Instruments-datasheet-24565342.pdf?src-supplier=Texas+Instruments; ComponentLink10Description: https://datasheet.octopart.com:443/SN74LVC1G07DBVT-Texas-Instruments-datasheet-24565342.pdf?src-supplier=Texas+Instruments; ComponentLink11URL: https://datasheet.octopart.com:443/SN74LVC1G07DBVT-Texas-Instruments-datasheet-16941355.pdf?src-supplier=Texas+Instruments; ComponentLink11Description: https://datasheet.octopart.com:443/SN74LVC1G07DBVT-Texas-Instruments-datasheet-16941355.pdf?src-supplier=Texas+Instruments; ComponentLink12URL: https://datasheet.octopart.com:443/SN74LVC1G07DBVT-Texas-Instruments-datasheet-13040538.pdf?src-supplier=Texas+Instruments; ComponentLink12Description: https://datasheet.octopart.com:443/SN74LVC1G07DBVT-Texas-Instruments-datasheet-13040538.pdf?src-supplier=Texas+Instruments; ComponentLink13URL: https://datasheet.octopart.com:443/SN74LVC1G07DBVT-Texas-Instruments-datasheet-153181.pdf?src-supplier=Texas+Instruments; ComponentLink13Description: https://datasheet.octopart.com:443/SN74LVC1G07DBVT-Texas-Instruments-datasheet-153181.pdf?src-supplier=Texas+Instruments; ComponentLink14URL: https://datasheet.octopart.com:443/SN74LVC1G07DBVT-Texas-Instruments-datasheet-10852091.pdf?src-supplier=HQonline; ComponentLink14Description: https://datasheet.octopart.com:443/SN74LVC1G07DBVT-Texas-Instruments-datasheet-10852091.pdf?src-supplier=HQonline; ComponentLink15URL: https://datasheet.octopart.com:443/SN74LVC1G07DBVT-Texas-Instruments-datasheet-8500040.pdf?src-supplier=Newark; ComponentLink15Description: https://datasheet.octopart.com:443/SN74LVC1G07DBVT-Texas-Instruments-datasheet-8500040.pdf?src-supplier=Newark; ComponentLink16URL: https://datasheet.octopart.com:443/SN74LVC1G07DBVT-Texas-Instruments-datasheet-5328147.pdf?src-supplier=Newark; ComponentLink16Description: https://datasheet.octopart.com:443/SN74LVC1G07DBVT-Texas-Instruments-datasheet-5328147.pdf?src-supplier=Newark; ComponentLink17URL: https://datasheet.octopart.com:443/SN74LVC1G07DBVT-Texas-Instruments-datasheet-65713477.pdf?src-supplier=Newark; ComponentLink17Description: https://datasheet.octopart.com:443/SN74LVC1G07DBVT-Texas-Instruments-datasheet-65713477.pdf?src-supplier=Newark; ComponentLink18URL: https://datasheet.octopart.com:443/SN74LVC1G07DBVT-Texas-Instruments-datasheet-37140337.pdf?src-supplier=Newark; ComponentLink18Description: https://datasheet.octopart.com:443/SN74LVC1G07DBVT-Texas-Instruments-datasheet-37140337.pdf?src-supplier=Newark; ComponentLink19URL: https://datasheet.octopart.com:443/SN74LVC1G07DBVT-Texas-Instruments-datasheet-33018797.pdf?src-supplier=Newark; ComponentLink19Description: https://datasheet.octopart.com:443/SN74LVC1G07DBVT-Texas-Instruments-datasheet-33018797.pdf?src-supplier=Newark; ComponentLink20URL: https://datasheet.octopart.com:443/SN74LVC1G07DBVT-Texas-Instruments-datasheet-43176.pdf?src-supplier=Newark; ComponentLink20Description: https://datasheet.octopart.com:443/SN74LVC1G07DBVT-Texas-Instruments-datasheet-43176.pdf?src-supplier=Newark; ComponentLink21URL: https://datasheet.octopart.com:443/SN74LVC1G07DBVT-Texas-Instruments-datasheet-165804489.pdf?src-supplier=LCSC; ComponentLink21Description: https://datasheet.octopart.com:443/SN74LVC1G07DBVT-Texas-Instruments-datasheet-165804489.pdf?src-supplier=LCSC; ComponentLink22URL: https://datasheet.octopart.com:443/SN74LVC1G07DBVT-Texas-Instruments-datasheet-164417647.pdf?src-supplier=SHENGYU+ELECTRONICS; ComponentLink22Description: https://datasheet.octopart.com:443/SN74LVC1G07DBVT-Texas-Instruments-datasheet-164417647.pdf?src-supplier=SHENGYU+ELECTRONICS; ComponentLink23URL: https://datasheet.octopart.com:443/SN74LVC1G07DBVT-Texas-Instruments-datasheet-21076814.pdf?src-supplier=Farnell; ComponentLink23Description: https://datasheet.octopart.com:443/SN74LVC1G07DBVT-Texas-Instruments-datasheet-21076814.pdf?src-supplier=Farnell; ComponentLink24URL: https://datasheet.octopart.com:443/SN74LVC1G07DBVT-Texas-Instruments-datasheet-11537500.pdf?src-supplier=Farnell; ComponentLink24Description: https://datasheet.octopart.com:443/SN74LVC1G07DBVT-Texas-Instruments-datasheet-11537500.pdf?src-supplier=Farnell; ComponentLink25URL: https://datasheet.octopart.com:443/SN74LVC1G07DBVT-Texas-Instruments-datasheet-10998566.pdf?src-supplier=Farnell; ComponentLink25Description: https://datasheet.octopart.com:443/SN74LVC1G07DBVT-Texas-Instruments-datasheet-10998566.pdf?src-supplier=Farnell; ComponentLink26URL: https://datasheet.octopart.com:443/SN74LVC1G07DBVT-Texas-Instruments-datasheet-8323564.pdf?src-supplier=Jameco; ComponentLink26Description: https://datasheet.octopart.com:443/SN74LVC1G07DBVT-Texas-Instruments-datasheet-8323564.pdf?src-supplier=Jameco; ComponentLink27URL: https://datasheet.octopart.com:443/SN74LVC1G07DBVT-Texas-Instruments-datasheet-33002.pdf?src-supplier=Sierra+IC; ComponentLink27Description: https://datasheet.octopart.com:443/SN74LVC1G07DBVT-Texas-Instruments-datasheet-33002.pdf?src-supplier=Sierra+IC; ComponentLink28URL: http://sigma.octopart.com:80/reach_statement/Texas-Instruments-company-64.pdf?src-supplier=Compliance+Statements; ComponentLink28Description: http://sigma.octopart.com:80/reach_statement/Texas-Instruments-company-64.pdf?src-supplier=Compliance+Statements; ComponentLink29URL: http://sigma.octopart.com:80/conflict_mineral_statement/Texas-Instruments-company-63.pdf?src-supplier=Compliance+Statements; ComponentLink29Description: http://sigma.octopart.com:80/conflict_mineral_statement/Texas-Instruments-company-63.pdf?src-supplier=Compliance+Statements
U?#16 = XC7Z010-2CLG400I: MPU Zynq-7000 Thumb-2 32-Bit 733MHz 1.2V/3.3V 400-Pin CS-BGA; Manufacturer: AMD; Core Architecture: ARM; Data Bus Width: 32b; Frequency: 766MHz; Interface: CAN, EBI/EMI, Ethernet, I2C, MMC, SD, SDIO, SPI, UART, USART, USB; Max Supply Voltage: 1.05V; Min Supply Voltage: 950mV; Number of I/Os: 130; Operating Supply Voltage: 1V; Peripherals: DMA; Speed Grade: -2; Supplier: Farnell; Supplier Part Number: 2831085; Manufacturer Part Number: XC7Z010-2CLG400I; RoHS: Compliant; Category: System on Chip (SoC); Stock: 89; Pricing: 1=78,2 (EUR); Case/Package: BGA; China RoHS: Compliant; Contact Plating: Copper, Silver, Tin; Height - Seated (Max): 1.6mm; Length: 17mm; Lifecycle Status: Production; Clock Frequency: 733MHz; Max Operating Temperature: 100°C; Min Operating Temperature: -40°C; Pins: 400; Number of Terminals: 400; Radiation Hardening: No; REACH SVHC: Yes; Terminal Pitch: 800µm; Width: 17mm; ComponentLink1URL: https://datasheet.octopart.com:443/XC7Z010-2CLG400I-AMD-datasheet-159618399.pdf?src-supplier=IHS; ComponentLink1Description: https://datasheet.octopart.com:443/XC7Z010-2CLG400I-AMD-datasheet-159618399.pdf?src-supplier=IHS; ComponentLink2URL: https://datasheet.octopart.com:443/XC7Z010-2CLG400I-Xilinx-datasheet-134531205.pdf?src-supplier=Upverter; ComponentLink2Description: https://datasheet.octopart.com:443/XC7Z010-2CLG400I-Xilinx-datasheet-134531205.pdf?src-supplier=Upverter; ComponentLink3URL: https://datasheet.octopart.com:443/XC7Z010-2CLG400I-AMD-datasheet-101617038.pdf?src-supplier=Farnell; ComponentLink3Description: https://datasheet.octopart.com:443/XC7Z010-2CLG400I-AMD-datasheet-101617038.pdf?src-supplier=Farnell; ComponentLink4URL: https://datasheet.octopart.com:443/XC7Z010-2CLG400I-Xilinx-datasheet-159009919.pdf?src-supplier=Augswan; ComponentLink4Description: https://datasheet.octopart.com:443/XC7Z010-2CLG400I-Xilinx-datasheet-159009919.pdf?src-supplier=Augswan
U?#17 U?#18 = MX52LM04A11-XSI: FLASH - NAND (MLC) Memory IC 32Gbit eMMC_5.1 200 MHz 153-LFBGA (11.5x13); Manufacturer: Macronix; Interface: Parallel, Serial; Clock Frequency: 200MHz; Max Supply Current: 45mA; Max Supply Voltage: 3.6V; Min Supply Voltage: 2.7V; Number of Circuits: 1; Operating Supply Voltage: 3.3V; Supplier: Mouser; Supplier Part Number: 95-52LM04A11XSIT; Manufacturer Part Number: MX52LM04A11-XSI; RoHS: Compliant; Category: Flash; Stock: 2048; Pricing: 1=35,48, 10=32,83, 50=31, 100=30,17, 1000=29,03, 10000=29,03 (USD); Country of Origin: Taiwan; Export Control Classification Number (ECCN) Code: EAR99; Height - Seated (Max): 800µm; Harmonized Tariff Schedule (HTS) Code: 8542.32.00.51; Introduction Date: 2019-09-24; Length: 13mm; Lifecycle Status: Production; Max Operating Temperature: 85°C; Min Operating Temperature: -40°C; Number of Terminals: 153; REACH SVHC: Yes; Temperature Grade: Industrial; Terminal Pitch: 500µm; Width: 11.5mm
X?#2 = ECS-2520MV-333.3-BN-TR: Oscillator XO 33.333MHz ±50ppm 15pF HCMOS 55% 1.8V/2.5V/3.3V 4-Pin Mini-CSMD T/R; Manufacturer: ECS International; Body Material: Ceramic; Fall Time: 7ns; Frequency: 33.3333MHz; Max Supply Current: 7mA; Max Supply Voltage: 3.6V; Min Supply Voltage: 1.6V; Supplier: Avnet; Supplier Part Number: ECS-2520MV-333.3-BN-TR; Manufacturer Part Number: ECS-2520MV-333.3-BN-TR; RoHS: Compliant; Category: Crystals; Stock: 6000; Pricing: 3000=0,99, 12000=0,985, 24000=0,98, 51000=0,975, 102000=0,97 (USD); Export Control Classification Number (ECCN) Code: EAR99; Frequency Stability: 50ppm; Introduction Date: 2018-03-21; Lifecycle Status: Production; Load Capacitance: 15pF; Max Operating Temperature: 85°C; Min Operating Temperature: -40°C; Mounting Technology: Surface Mount; Number of Terminals: 4; REACH SVHC: Yes; Rise Time: 7ns; Schedule B: 8542310000, 8542310000|8542310000|8542310000|8542310000|8542310000|8542310000|8542310000|8542310000|8542310000|8542310000|8542310000|8542310000|8542310000|8542310000|8542310000|8542310000|8542310000|8542310000|8542310000|8542310000|8542310000|8542310000|8542310000|85, 8542390000; ComponentLink1URL: https://datasheet.octopart.com:443/ECS-2520MV-333.3-BN-TR-ECS-International-datasheet-179230857.pdf?src-supplier=IHS; ComponentLink1Description: https://datasheet.octopart.com:443/ECS-2520MV-333.3-BN-TR-ECS-International-datasheet-179230857.pdf?src-supplier=IHS; ComponentLink2URL: https://datasheet.octopart.com:443/ECS-2520MV-333.3-BN-TR-ECS-International-datasheet-104167383.pdf?src-supplier=Master+Electronics; ComponentLink2Description: https://datasheet.octopart.com:443/ECS-2520MV-333.3-BN-TR-ECS-International-datasheet-104167383.pdf?src-supplier=Master+Electronics; ComponentLink3URL: https://datasheet.octopart.com:443/ECS-2520MV-333.3-BN-TR-ECS-International-datasheet-189099886.pdf?src-supplier=Master+Electronics; ComponentLink3Description: https://datasheet.octopart.com:443/ECS-2520MV-333.3-BN-TR-ECS-International-datasheet-189099886.pdf?src-supplier=Master+Electronics